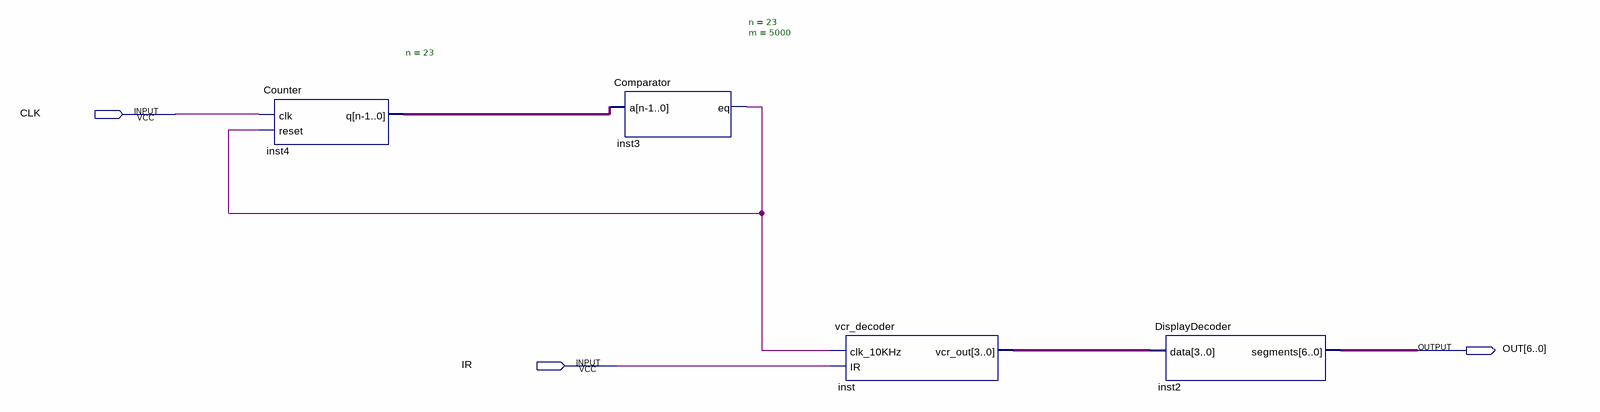
[diagram p0: schematic sheet]
// Quartus schematic VCR_Functional_Unit.bdf as structural Verilog: 4 symbols, 3 pins
module VCR_Functional_Unit (
  input  CLK,
  input  IR,
  output [6:0] OUT
);

  wire inst3_eq;
  wire [3:0] inst_vcr_out;
  wire [22:0] inst4_q;

  Counter #(.n(23)) inst4 (.clk(CLK), .reset(inst3_eq), .q(inst4_q));
  Comparator #(.n(23), .m(5000)) inst3 (.a(inst4_q), .eq(inst3_eq));
  vcr_decoder inst (.clk_10KHz(inst3_eq), .IR(IR), .vcr_out(inst_vcr_out));
  DisplayDecoder inst2 (.data(inst_vcr_out), .segments(OUT));
endmodule
